# Altium schematic sheet Shutdown_2019_v1.1_6.SchDoc: Shutdown_2019_v1.1
size 453 x 301 mm; Date: 1/4/2019 10:42:22 PM; SheetNumber: 7; GateName_1: G$1; SymbolName_1: FRAME_B_L; LibraryName: frames; DeviceSetName: FRAME_B_L; GateName_2: G$2; SymbolName_2: DOCFIELD
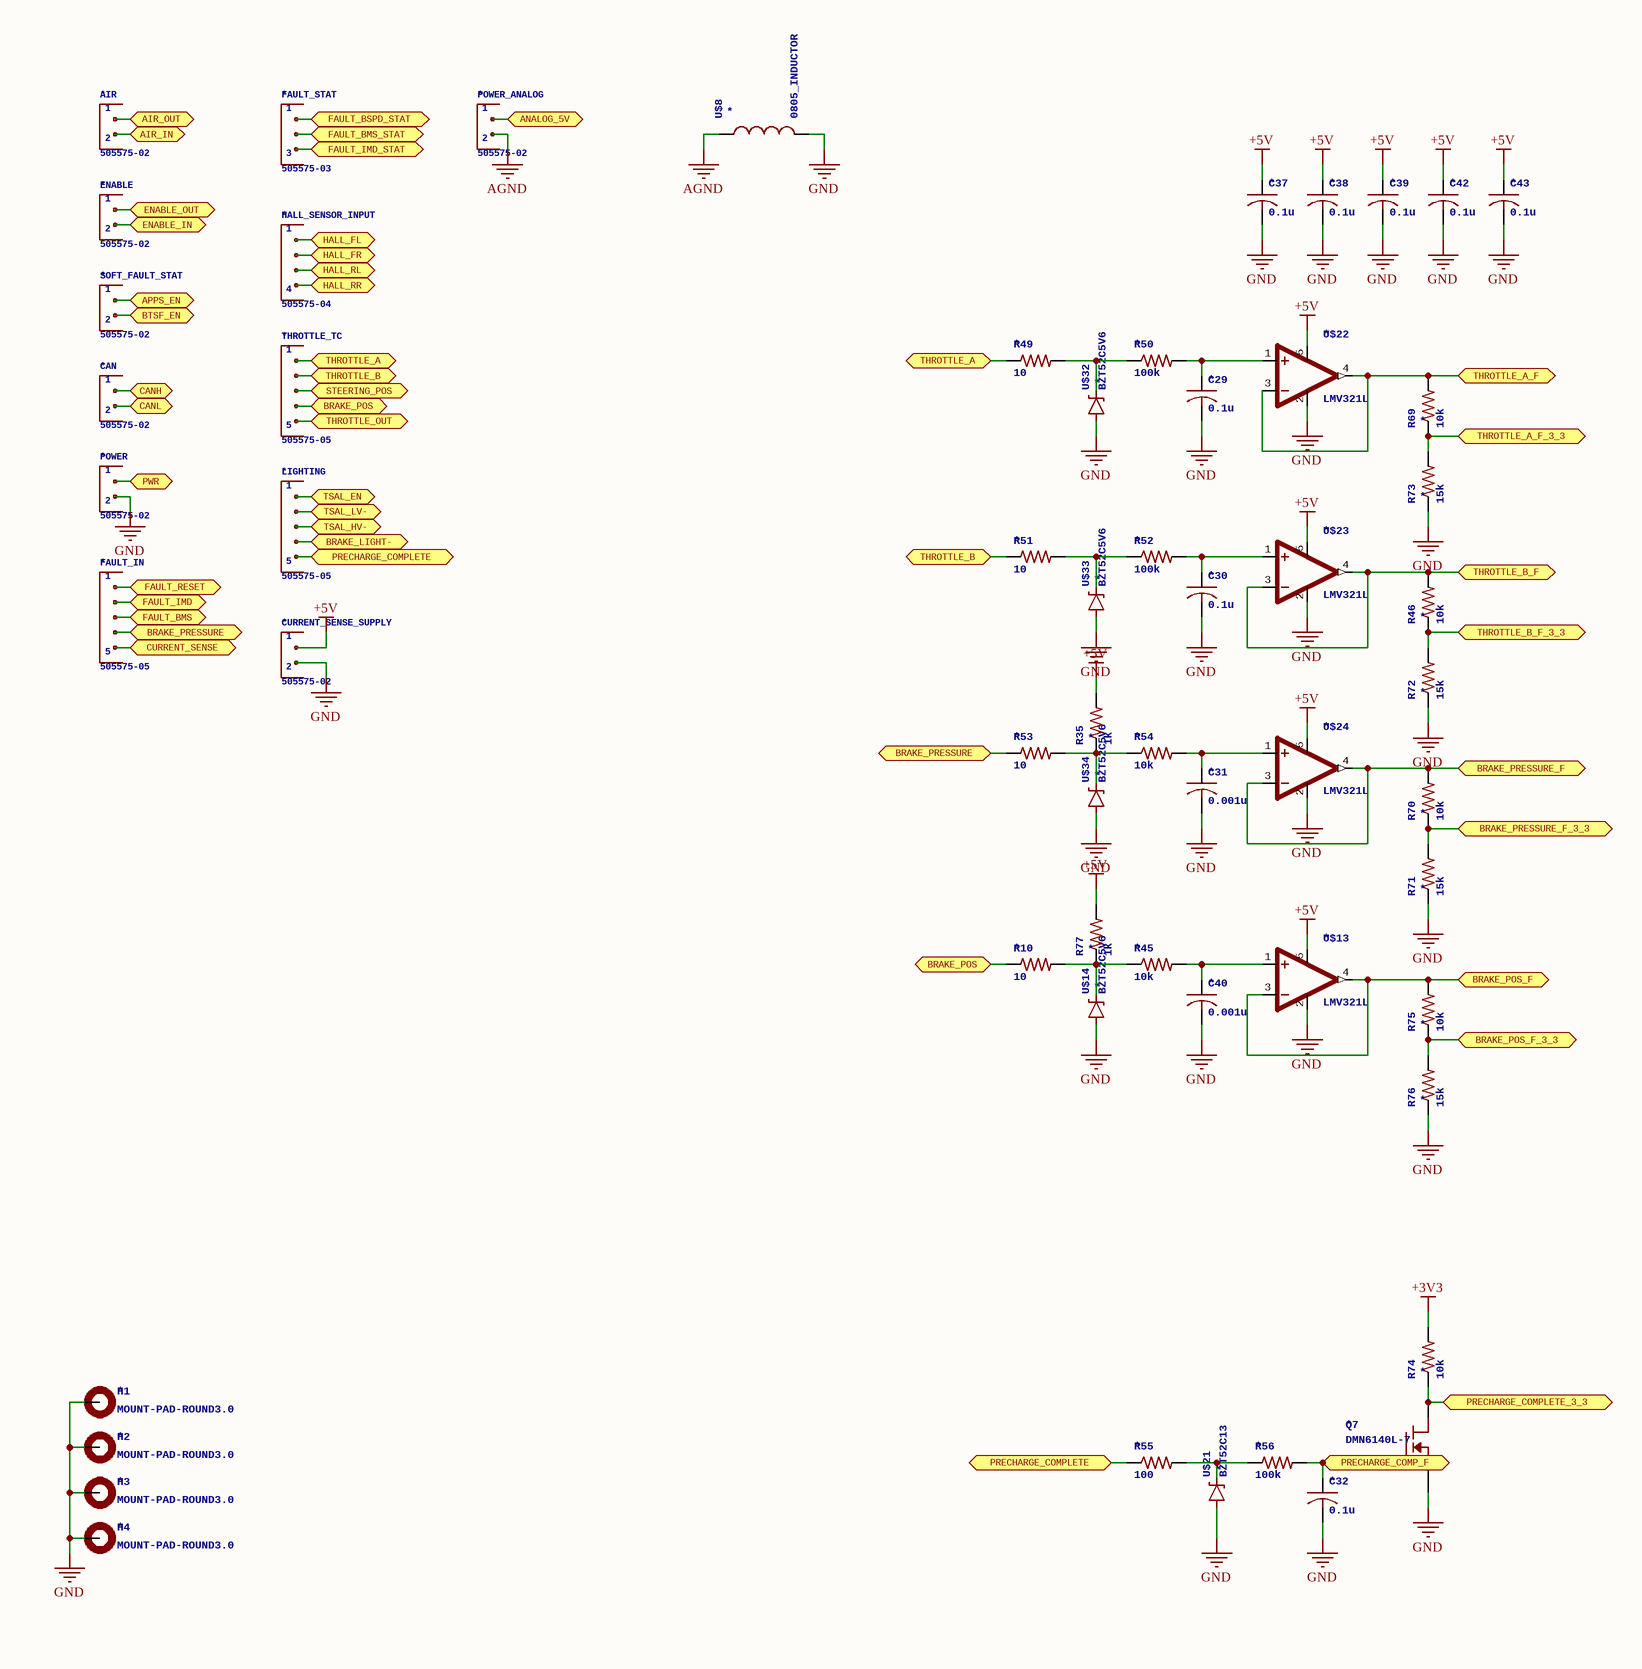
[diagram p0: Shutdown_2019_v1.1_6.SchDoc, left]
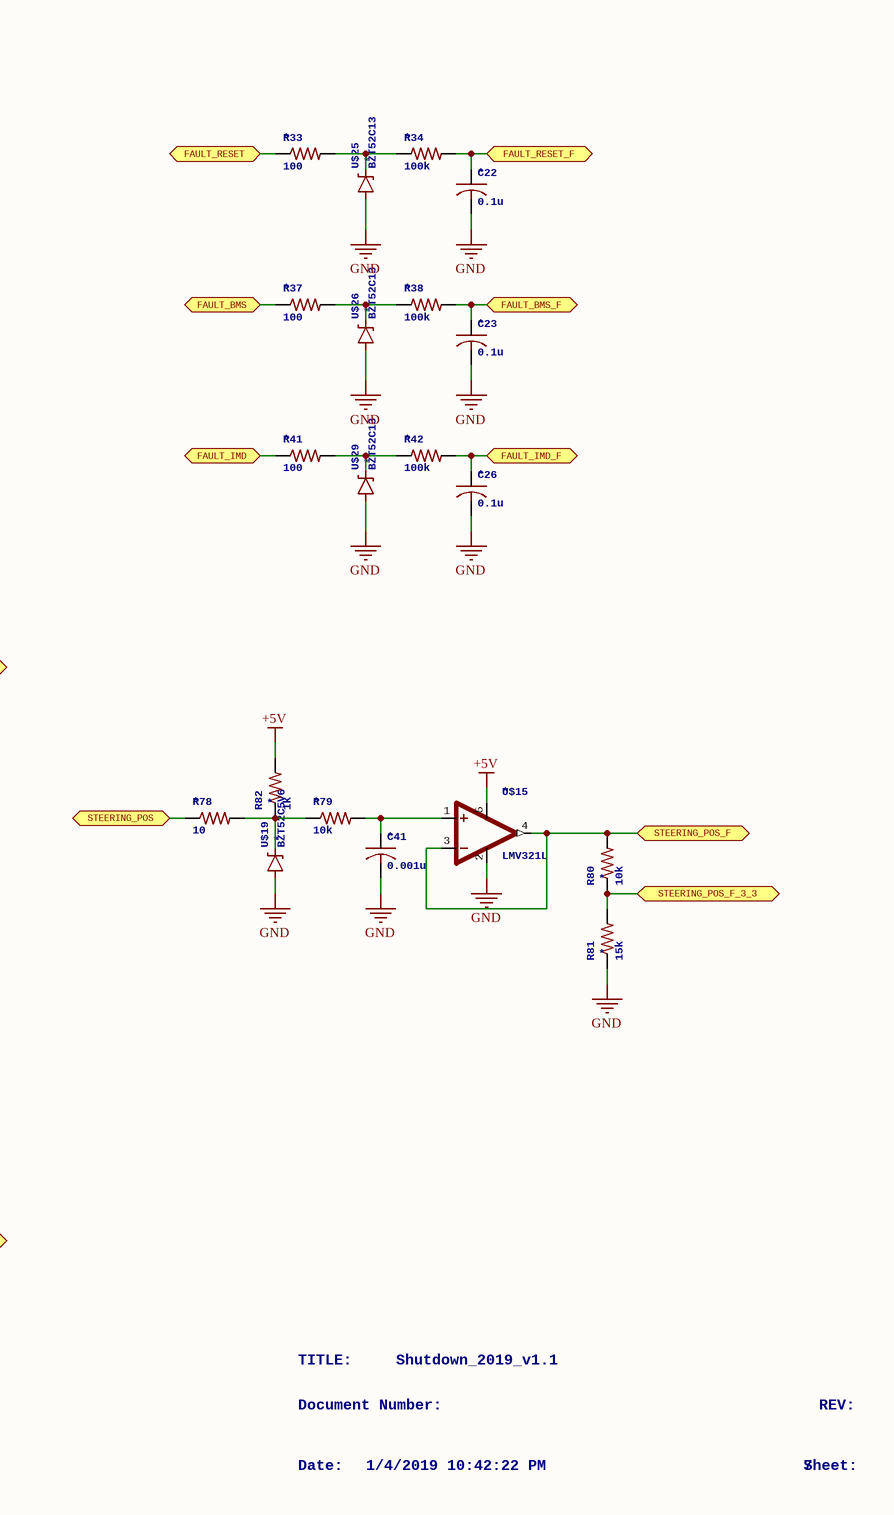
[diagram p1: Shutdown_2019_v1.1_6.SchDoc, right]

## Parts
AIR  505575-02  [505575-02]
C22  0.1u  [C0805]
C23  0.1u  [C0805]
C26  0.1u  [C0805]
C29  0.1u  [C0805]
C30  0.1u  [C0805]
C31  0.001u  [C0805]
C32  0.1u  [C0805]
C37  0.1u  [C0603]
C38  0.1u  [C0603]
C39  0.1u  [C0603]
C40  0.001u  [C0805]
C41  0.001u  [C0805]
C42  0.1u  [C0603]
C43  0.1u  [C0603]
CAN  505575-02  [505575-02]
CURRENT_SENSE_SUPPLY  505575-02  [505575-02]
ENABLE  505575-02  [505575-02]
FAULT_IN  505575-05  [505575-05]
FAULT_STAT  505575-03  [505575-03]
H1  MOUNT-PAD-ROUND3.0  [3,0-PAD]
H2  MOUNT-PAD-ROUND3.0  [3,0-PAD]
H3  MOUNT-PAD-ROUND3.0  [3,0-PAD]
H4  MOUNT-PAD-ROUND3.0  [3,0-PAD]
HALL_SENSOR_INPUT  505575-04  [505575-04]
LIGHTING  505575-05  [505575-05]
POWER  505575-02  [505575-02]
POWER_ANALOG  505575-02  [505575-02]
Q7  DMN6140L-7  [SOT23]
R10  10  [R0603]
R33  100  [R0603]
R34  100k  [R0603]
R35  1k  [R0603]
R37  100  [R0603]
R38  100k  [R0603]
R41  100  [R0603]
R42  100k  [R0603]
R45  10k  [R0603]
R46  10k  [R0603]
R49  10  [R0603]
R50  100k  [R0603]
R51  10  [R0603]
R52  100k  [R0603]
R53  10  [R0603]
R54  10k  [R0603]
R55  100  [R0603]
R56  100k  [R0603]
R69  10k  [R0603]
R70  10k  [R0603]
R71  15k  [R0603]
R72  15k  [R0603]
R73  15k  [R0603]
R74  10k  [R0603]
R75  10k  [R0603]
R76  15k  [R0603]
R77  1k  [R0603]
R78  10  [R0603]
R79  10k  [R0603]
R80  10k  [R0603]
R81  15k  [R0603]
R82  1k  [R0603]
SOFT_FAULT_STAT  505575-02  [505575-02]
THROTTLE_TC  505575-05  [505575-05]
U$8  0805_INDUCTOR  [L0805]
U$13  LMV321L  [SOT23-5]
U$14  BZT52C5V6  [SOD-123]
U$15  LMV321L  [SOT23-5]
U$19  BZT52C5V6  [SOD-123]
U$21  BZT52C13  [SOD-123]
U$22  LMV321L  [SOT23-5]
U$23  LMV321L  [SOT23-5]
U$24  LMV321L  [SOT23-5]
U$25  BZT52C13  [SOD-123]
U$26  BZT52C13  [SOD-123]
U$29  BZT52C13  [SOD-123]
U$32  BZT52C5V6  [SOD-123]
U$33  BZT52C5V6  [SOD-123]
U$34  BZT52C5V6  [SOD-123]

## Ports
AIR_IN, AIR_OUT, ANALOG_5V, APPS_EN, BRAKE_LIGHT-, BRAKE_POS, BRAKE_POS_F, BRAKE_POS_F_3_3, BRAKE_PRESSURE, BRAKE_PRESSURE_F, BRAKE_PRESSURE_F_3_3, BTSF_EN, CANH, CANL, CURRENT_SENSE, ENABLE_IN, ENABLE_OUT, FAULT_BMS, FAULT_BMS_F, FAULT_BMS_STAT, FAULT_BSPD_STAT, FAULT_IMD, FAULT_IMD_F, FAULT_IMD_STAT, FAULT_RESET, FAULT_RESET_F, HALL_FL, HALL_FR, HALL_RL, HALL_RR, PRECHARGE_COMP_F, PRECHARGE_COMPLETE, PRECHARGE_COMPLETE_3_3, PWR, STEERING_POS, STEERING_POS_F, STEERING_POS_F_3_3, THROTTLE_A, THROTTLE_A_F, THROTTLE_A_F_3_3, THROTTLE_B, THROTTLE_B_F, THROTTLE_B_F_3_3, THROTTLE_OUT, TSAL_EN, TSAL_HV-, TSAL_LV-

## Nets
+3V3: R74.2
+5V: C37.1 C38.1 C39.1 C42.1 C43.1 CURRENT_SENSE_SUPPLY.1 R35.2 R77.2 R82.2 U$13.5(VDD) U$15.5(VDD) U$22.5(VDD) U$23.5(VDD) U$24.5(VDD)
AGND: POWER_ANALOG.2 U$8.1
GND: C22.2 C23.2 C26.2 C29.2 C30.2 C31.2 C32.2 C37.2 C38.2 C39.2 C40.2 C41.2 C42.2 C43.2 CURRENT_SENSE_SUPPLY.2 H1.B3,0(MOUNT) H2.B3,0(MOUNT) H3.B3,0(MOUNT) H4.B3,0(MOUNT) POWER.2 Q7.2(S) R71.1 R72.1 R73.1 R76.1 R81.1 U$8.2 U$13.2(GND) U$14.A U$15.2(GND) U$19.A U$21.A U$22.2(GND) U$23.2(GND) U$24.2(GND) U$25.A U$26.A U$29.A U$32.A U$33.A U$34.A
AIR_IN: AIR.2 ; port AIR_IN
AIR_OUT: AIR.1 ; port AIR_OUT
ANALOG_5V: POWER_ANALOG.1 ; port ANALOG_5V
APPS_EN: SOFT_FAULT_STAT.1 ; port APPS_EN
BRAKE_LIGHT-: LIGHTING.4 ; port BRAKE_LIGHT-
BRAKE_POS: R10.1 THROTTLE_TC.4 ; port BRAKE_POS
BRAKE_POS_F: R75.2 U$13.3(-IN) U$13.4(OUT) ; port BRAKE_POS_F
BRAKE_POS_F_3_3: R75.1 R76.2 ; port BRAKE_POS_F_3_3
BRAKE_PRESSURE: FAULT_IN.4 R53.1 ; port BRAKE_PRESSURE
BRAKE_PRESSURE_F: R70.2 U$24.3(-IN) U$24.4(OUT) ; port BRAKE_PRESSURE_F
BRAKE_PRESSURE_F_3_3: R70.1 R71.2 ; port BRAKE_PRESSURE_F_3_3
BTSF_EN: SOFT_FAULT_STAT.2 ; port BTSF_EN
CANH: CAN.1 ; port CANH
CANL: CAN.2 ; port CANL
CURRENT_SENSE: FAULT_IN.5 ; port CURRENT_SENSE
ENABLE_IN: ENABLE.2 ; port ENABLE_IN
ENABLE_OUT: ENABLE.1 ; port ENABLE_OUT
FAULT_BMS: FAULT_IN.3 R37.1 ; port FAULT_BMS
FAULT_BMS_F: C23.1 R38.2 ; port FAULT_BMS_F
FAULT_BMS_STAT: FAULT_STAT.2 ; port FAULT_BMS_STAT
FAULT_BSPD_STAT: FAULT_STAT.1 ; port FAULT_BSPD_STAT
FAULT_IMD: FAULT_IN.2 R41.1 ; port FAULT_IMD
FAULT_IMD_F: C26.1 R42.2 ; port FAULT_IMD_F
FAULT_IMD_STAT: FAULT_STAT.3 ; port FAULT_IMD_STAT
FAULT_RESET: FAULT_IN.1 R33.1 ; port FAULT_RESET
FAULT_RESET_F: C22.1 R34.2 ; port FAULT_RESET_F
HALL_FL: HALL_SENSOR_INPUT.1 ; port HALL_FL
HALL_FR: HALL_SENSOR_INPUT.2 ; port HALL_FR
HALL_RL: HALL_SENSOR_INPUT.3 ; port HALL_RL
HALL_RR: HALL_SENSOR_INPUT.4 ; port HALL_RR
PRECHARGE_COMP_F: C32.1 Q7.1(G) R56.2 ; port PRECHARGE_COMP_F
PRECHARGE_COMPLETE: LIGHTING.5 R55.1 ; port PRECHARGE_COMPLETE
PRECHARGE_COMPLETE_3_3: Q7.3(D) R74.1 ; port PRECHARGE_COMPLETE_3_3
PWR: POWER.1 ; port PWR
STEERING_POS: R78.1 THROTTLE_TC.3 ; port STEERING_POS
STEERING_POS_F: R80.2 U$15.3(-IN) U$15.4(OUT) ; port STEERING_POS_F
STEERING_POS_F_3_3: R80.1 R81.2 ; port STEERING_POS_F_3_3
THROTTLE_A: R49.1 THROTTLE_TC.1 ; port THROTTLE_A
THROTTLE_A_F: R69.2 U$22.3(-IN) U$22.4(OUT) ; port THROTTLE_A_F
THROTTLE_A_F_3_3: R69.1 R73.2 ; port THROTTLE_A_F_3_3
THROTTLE_B: R51.1 THROTTLE_TC.2 ; port THROTTLE_B
THROTTLE_B_F: R46.2 U$23.3(-IN) U$23.4(OUT) ; port THROTTLE_B_F
THROTTLE_B_F_3_3: R46.1 R72.2 ; port THROTTLE_B_F_3_3
THROTTLE_OUT: THROTTLE_TC.5 ; port THROTTLE_OUT
TSAL_EN: LIGHTING.1 ; port TSAL_EN
TSAL_HV-: LIGHTING.3 ; port TSAL_HV-
TSAL_LV-: LIGHTING.2 ; port TSAL_LV-
NetC29_1: C29.1 R50.2 U$22.1(+IN)
NetC30_1: C30.1 R52.2 U$23.1(+IN)
NetC31_1: C31.1 R54.2 U$24.1(+IN)
NetC40_1: C40.1 R45.2 U$13.1(+IN)
NetC41_1: C41.1 R79.2 U$15.1(+IN)
NetR10_2: R10.2 R45.1 R77.1 U$14.C
NetR33_2: R33.2 R34.1 U$25.C
NetR35_1: R35.1 R53.2 R54.1 U$34.C
NetR37_2: R37.2 R38.1 U$26.C
NetR41_2: R41.2 R42.1 U$29.C
NetR49_2: R49.2 R50.1 U$32.C
NetR51_2: R51.2 R52.1 U$33.C
NetR55_2: R55.2 R56.1 U$21.C
NetR78_2: R78.2 R79.1 R82.1 U$19.C

## Notes on the sheet
- TITLE:
- Document Number:
- Shutdown_2019_v1.1
- REV:
- Date:
- 1/4/2019 10:42:22 PM
- Sheet:
- 7
- 1
- 2
- 3
- 4
- 5
- 6
- 8
- 9
- A
- B
- C
- D
- E
- F

## Library data of the parts
AIR CAN CURRENT_SENSE_SUPPLY ENABLE POWER POWER_ANALOG SOFT_FAULT_STAT = 505575-02: Molex 505575-02 2 Position 2.00mm pitch connector wire to board connector Datasheet; GateName_1: G$1; SymbolName_1: 2POS; LibraryName: MOLEX; DeviceSetName: 505575-02; NAME: *; 1: 1; 2: 2
C22 C23 C26 C29-C32 C40 C41 = C-USC0805: CAPACITOR, American symbol; GateName_1: G$1; SymbolName_1: C-US; DeviceName: C0805; LibraryName: rcl; DeviceSetName: C-US; NAME: *; SPICEPREFIX: C
C37-C39 C42 C43 = C-USC0603: CAPACITOR, American symbol; GateName_1: G$1; SymbolName_1: C-US-1; DeviceSetName: C-US; DeviceName: C0603; LibraryName: resistor; NAME: *
FAULT_IN LIGHTING THROTTLE_TC = 505575-05: Molex 505575-05 5 Position 2.00mm pitch connector wire to board connector Datasheet; GateName_1: G$1; SymbolName_1: 5POS; LibraryName: MOLEX; DeviceSetName: 505575-05; NAME: *; 1: 1; 5: 5
FAULT_STAT = 505575-03: Molex 505575-03 3 Position 2.00mm pitch connector wire to board connector Datasheet; GateName_1: G$1; SymbolName_1: 3POS; LibraryName: MOLEX; DeviceSetName: 505575-03; NAME: *; 1: 1; 3: 3
H1-H4 = MOUNT-PAD-ROUND3.0: MOUNTING PAD, round; GateName_1: G$1; DeviceName: 3.0; SymbolName_1: MOUNT-PAD; LibraryName: holes; DeviceSetName: MOUNT-PAD-ROUND; NAME: *
HALL_SENSOR_INPUT = 505575-04: Molex 505575-04 4 Position 2.00mm pitch connector wire to board connector Datasheet; GateName_1: G$1; SymbolName_1: 4POS; LibraryName: MOLEX; DeviceSetName: 505575-04; NAME: *; 1: 1; 4: 4
Q7 = DMN6140L-7: DMN6140L-7 Vgs(th) = 3V, Rds(on) = 140mOhm, Vds(max) = 60V; GateName_1: G$1; SymbolName_1: N-MOSFET-GDS; LibraryName: TRANS; DeviceSetName: DMN6140L-7; NAME: *
R10 R33-R35 R37 R38 R41 R42 R45 R46 R49-R56 R69-R82 = R-US_R0603: RESISTOR, American symbol; GateName_1: G$1; SymbolName_1: R-US; DeviceSetName: R-US_; DeviceName: R0603; LibraryName: rcl; NAME: *; SPICEPREFIX: R
U$8 = 0805_INDUCTOR: GateName_1: G$1; SymbolName_1: INDUCTOR; LibraryName: Display_Custom; DeviceSetName: 0805_INDUCTOR; NAME: *
U$13 U$15 U$22-U$24 = LMV321L: STM LMV321LRail to Rail General Purpose Op-AmpDatasheet; GateName_1: G$1; SymbolName_1: OP-AMP; LibraryName: STM; DeviceSetName: LMV321L; NAME: *
U$14 U$19 U$21 U$25 U$26 U$29 U$32-U$34 = BZT52C: DIODES INC BZT52C Small form factor Zener Diode Datasheet; GateName_1: G$1; SymbolName_1: DIODE-ZENER; LibraryName: DIODES_INC; DeviceSetName: BZT52C; NAME: *